# Altium schematic sheet output_jack.SchDoc
size A4
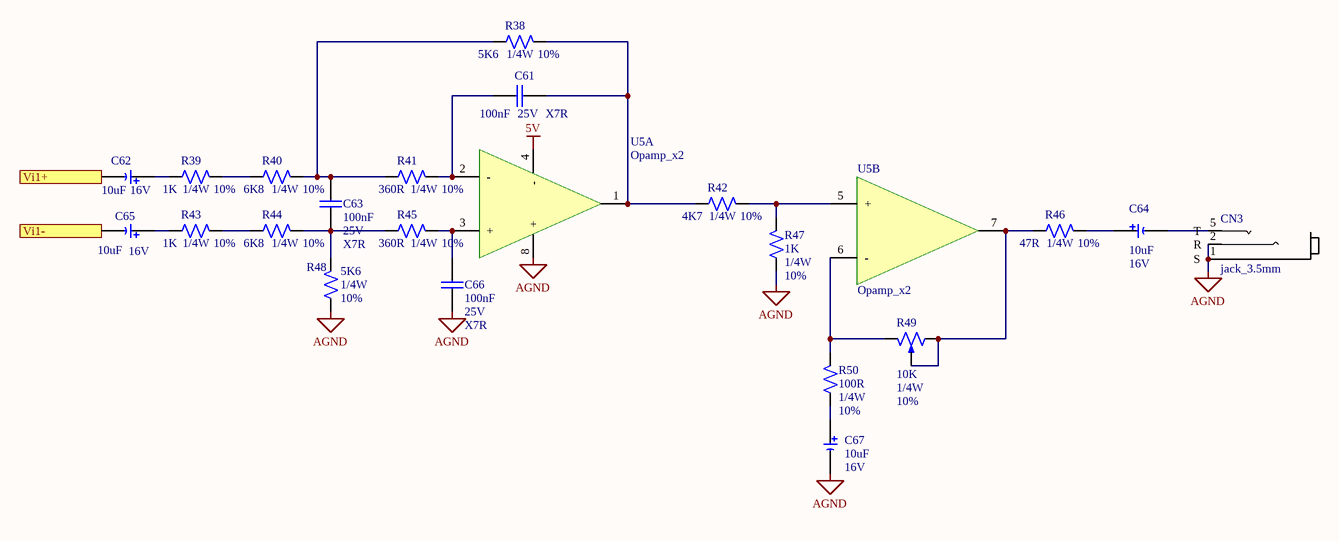
[diagram p0: output_jack.SchDoc]

## Parts
C61  valor: 100nF  tension: 25V  tolerancia: X7R  [C0805]  (hidden comment: Capacitor)
C62  Valor: 10uF  tension: 16V  [CAP_Electrolytic]  (hidden comment: Capacitor polarizado)
C63  valor: 100nF  tension: 25V  tolerancia: X7R  [C0805]  (hidden comment: Capacitor)
C64  Valor: 10uF  tension: 16V  [CAP_Electrolytic]  (hidden comment: Capacitor polarizado)
C65  Valor: 10uF  tension: 16V  [CAP_Electrolytic]  (hidden comment: Capacitor polarizado)
C66  valor: 100nF  tension: 25V  tolerancia: X7R  [C0805]  (hidden comment: Capacitor)
C67  Valor: 10uF  tension: 16V  [CAP_Electrolytic]  (hidden comment: Capacitor polarizado)
CN3  jack_3.5mm  [Jack 3.5mm]
R38  Valor: 5K6  Potencia: 1/4W  Tolerancia: 10%  [R0805]  (hidden comment: Resistor)
R39  Valor: 1K  Potencia: 1/4W  Tolerancia: 10%  [R0805]  (hidden comment: Resistor)
R40  Valor: 6K8  Potencia: 1/4W  Tolerancia: 10%  [R0805]  (hidden comment: Resistor)
R41  Valor: 360R  Potencia: 1/4W  Tolerancia: 10%  [R0805]  (hidden comment: Resistor)
R42  Valor: 4K7  Potencia: 1/4W  Tolerancia: 10%  [R0805]  (hidden comment: Resistor)
R43  Valor: 1K  Potencia: 1/4W  Tolerancia: 10%  [R0805]  (hidden comment: Resistor)
R44  Valor: 6K8  Potencia: 1/4W  Tolerancia: 10%  [R0805]  (hidden comment: Resistor)
R45  Valor: 360R  Potencia: 1/4W  Tolerancia: 10%  [R0805]  (hidden comment: Resistor)
R46  Valor: 47R  Potencia: 1/4W  Tolerancia: 10%  [R0805]  (hidden comment: Resistor)
R47  Valor: 1K  Potencia: 1/4W  Tolerancia: 10%  [R0805]  (hidden comment: Resistor)
R48  Valor: 5K6  Potencia: 1/4W  Tolerancia: 10%  [R0805]  (hidden comment: Resistor)
R49  valor: 10K  Potencia: 1/4W  Tolerancia: 10%  [Header 3x1]  (hidden comment: Potenciometro)
R50  Valor: 100R  Potencia: 1/4W  Tolerancia: 10%  [R0805]  (hidden comment: Resistor)
U5  Opamp_x2  [D8]  (parts A,B of 2)

## Ports
Vi1+ (in), Vi1- (in)

## Nets
5V: U5.4(-)
AGND: C66.2 C67.2 CN3.1(S) CN3.2(R) R47.1 R48.1 U5.8(+)
Vi1+: C62.2 ; port Vi1+
Vi1-: C65.2 ; port Vi1-
NetC61_1: C61.1 R38.2 R42.1 U5.1(OUT)
NetC61_2: C61.2 R41.2 U5.2(-)
NetC62_1: C62.1 R39.1
NetC63_1: C63.1 R38.1 R40.2 R41.1
NetC63_2: C63.2 R44.2 R45.1 R48.2
NetC64_1: C64.1 R46.2
NetC64_2: C64.2 CN3.5(T)
NetC65_1: C65.1 R43.1
NetC66_1: C66.1 R45.2 U5.3(+)
NetC67_1: C67.1 R50.1
NetR39_2: R39.2 R40.1
NetR42_2: R42.2 R47.2 U5.5(+)
NetR43_2: R43.2 R44.1
NetR46_1: R46.1 R49.2(Punto_medio) R49.3(Right) U5.7(OUT)
NetR49_1: R49.1(Left) R50.2 U5.6(-)

## Library data of the parts
C61 C63 C66 = Capacitor: Capacitor de placas paralelas; Encapsulado: 0805
R38-R48 R50 = Resistor: Resistencia
R49 = Potenciometer: Link: *; Fabricante: *
U5 = Opamp_x2: Integrado con 2 operacionales
C62 C64 C65 C67 = Capacitor polarizado: Link: *; Fabricante: *
CN3 = jack_3.5mm: Cod. Proveedor: *; Encapsulado: *; Link: *; Proveedor: *; Fabricante: *